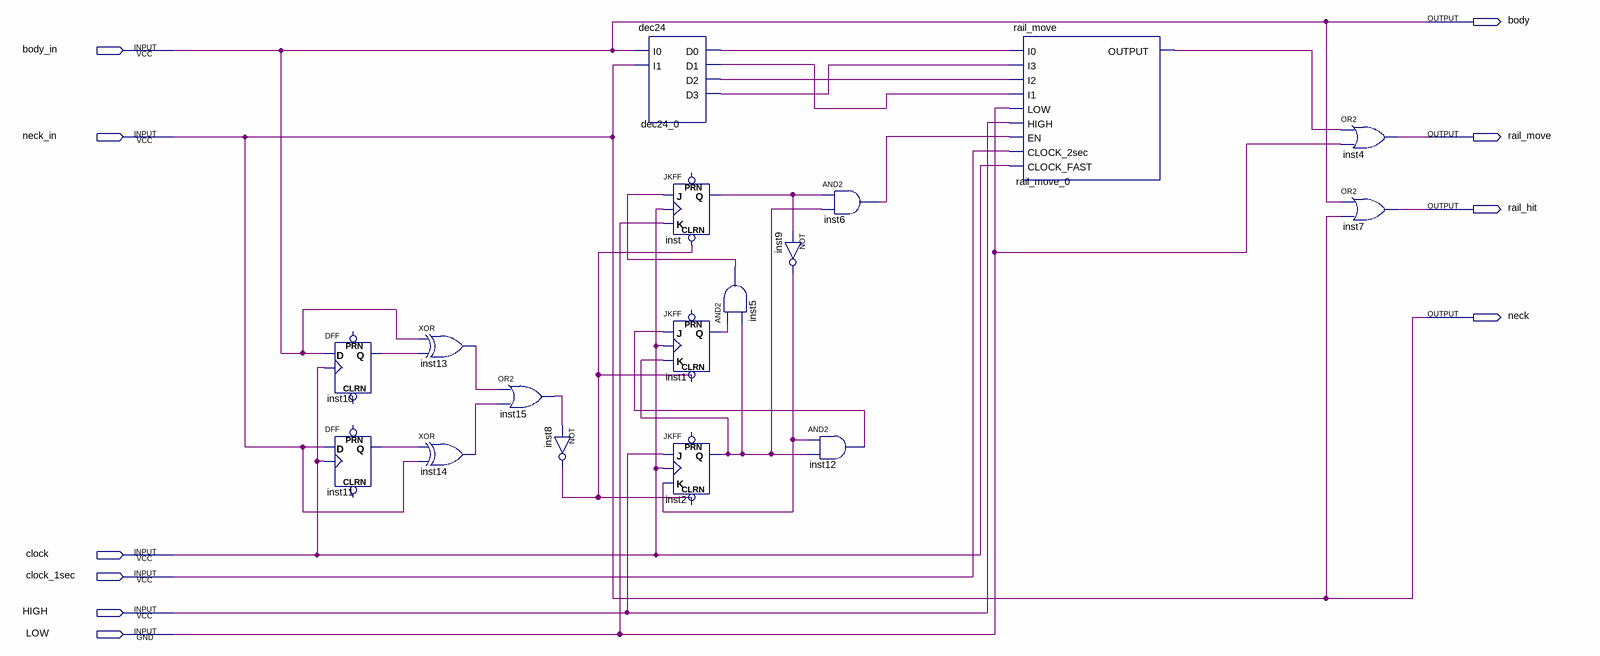
[diagram p0: schematic sheet]
// Quartus schematic Body.bdf as structural Verilog: 17 symbols, 10 pins
module Body (
  input  body_in,
  input  neck_in,
  input  clock,
  input  clock_1sec,
  input  HIGH,
  input  LOW,
  output body,
  output rail_move,
  output rail_hit,
  output neck
);

  wire dec24_0_d0, dec24_0_d1, dec24_0_d2, dec24_0_d3, inst1_q, inst2_q, inst5_out, inst6_out, inst8_out,
       inst9_out, inst10_q, inst11_q, inst12_out, inst13_out, inst14_out, inst15_out, inst_q,
       rail_move_0_output;

  DFF inst10 (.CLK(clock), .D(body_in), .Q(inst10_q));  // open: CLRN, PRN
  DFF inst11 (.CLK(clock), .D(neck_in), .Q(inst11_q));  // open: CLRN, PRN
  xor inst13 (inst13_out, body_in, inst10_q);
  xor inst14 (inst14_out, inst11_q, neck_in);
  or inst15 (inst15_out, inst13_out, inst14_out);
  not inst8 (inst8_out, inst15_out);
  dec24 dec24_0 (.I0(body_in), .I1(neck_in), .D0(dec24_0_d0), .D1(dec24_0_d1), .D2(dec24_0_d2), .D3(dec24_0_d3));
  JKFF inst (.CLRN(inst8_out), .K(LOW), .J(inst5_out), .CLK(clock), .Q(inst_q));  // open: PRN
  JKFF inst1 (.CLRN(inst8_out), .K(inst2_q), .J(inst12_out), .CLK(clock), .Q(inst1_q));  // open: PRN
  JKFF inst2 (.CLRN(inst8_out), .K(inst9_out), .J(HIGH), .CLK(clock), .Q(inst2_q));  // open: PRN
  and inst5 (inst5_out, inst1_q, inst2_q);
  not inst9 (inst9_out, inst_q);
  and inst12 (inst12_out, inst9_out, inst2_q);
  and inst6 (inst6_out, inst_q, inst2_q);
  rail_move rail_move_0 (
    .I0(dec24_0_d0), .I3(dec24_0_d3), .I2(dec24_0_d2), .I1(dec24_0_d1), .LOW(LOW), .HIGH(HIGH),
    .EN(inst6_out), .CLOCK_2sec(clock_1sec), .CLOCK_FAST(clock), .OUTPUT(rail_move_0_output));
  or inst4 (rail_move, rail_move_0_output, LOW);
  or inst7 (rail_hit, body_in, neck_in);

  assign body = body_in;
  assign neck = neck_in;
endmodule
